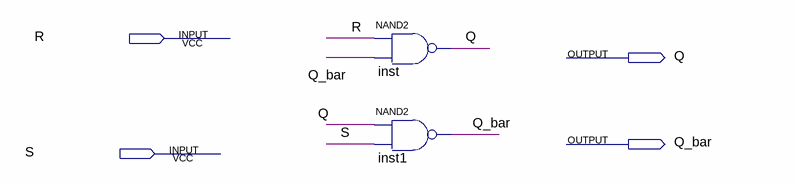
[diagram p0: schematic sheet]
// Quartus schematic RS_Latch_NAND.bdf as structural Verilog: 2 symbols, 4 pins
module RS_Latch_NAND (
  input  R,
  input  S,
  output Q,
  output Q_bar
);

  nand inst (Q, R, Q_bar);
  nand inst1 (Q_bar, Q, S);
endmodule
